# Altium schematic sheet [05] INERTIAL SENSOR.SchDoc: Template
size A4; Author: Hom; CompanyName: KitSprout; DrawnBy: Hom; Engineer: Hom; Organization: KitSprout; Revision: A; SheetNumber: 5; SheetTotal: 6; Version: 0.0; LibVersion: 0.0
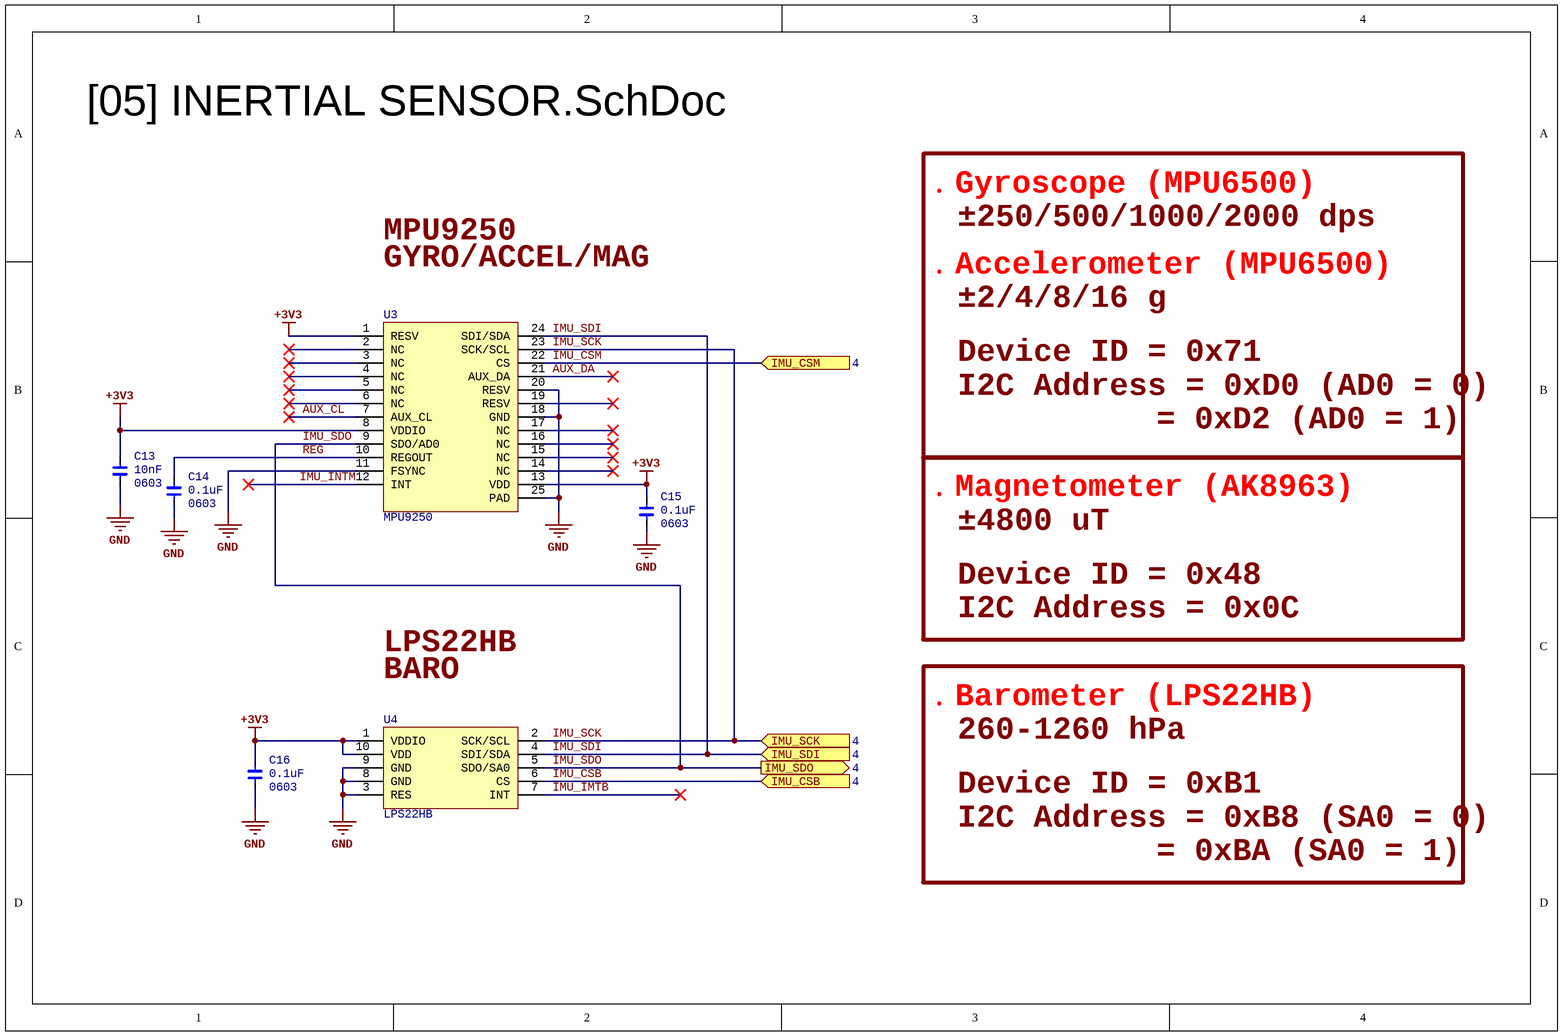
[diagram p0: [05] INERTIAL SENSOR.SchDoc]

## Parts
C13  Type: 0603  [CAP_0603]  (hidden comment: 10nF)
C14  Type: 0603  [CAP_0603]  (hidden comment: 0.1uF)
C15  Type: 0603  [CAP_0603]  (hidden comment: 0.1uF)
C16  Type: 0603  [CAP_0603]  (hidden comment: 0.1uF)
U3  MPU9250  [QFN_P0.4_24]
U4  LPS22HB  [HCLGA-2x2_10]

## Ports
IMU_CSB (in, see 4), IMU_CSM (in, see 4), IMU_SCK (in, see 4), IMU_SDI (in, see 4), IMU_SDO (out, see 4)

## Nets
+3V3: C13.2 C15.2 C16.2 U3.1(RESV) U3.8(VDDIO) U3.13(VDD) U4.1(VDDIO) U4.10(VDD)
GND: C13.1 C14.1 C15.1 C16.1 U3.11(FSYNC) U3.18(GND) U3.20(RESV) U3.25(PAD) U4.3(RES) U4.8(GND) U4.9(GND)
AUX_CL: U3.7(AUX_CL)
AUX_DA: U3.21(AUX_DA)
IMU_CSB: U4.6(CS) ; port IMU_CSB
IMU_CSM: U3.22(CS) ; port IMU_CSM
IMU_IMTB: U4.7(INT)
IMU_INTM: U3.12(INT)
IMU_SCK: U3.23(SCK/SCL) U4.2(SCK/SCL) ; port IMU_SCK
IMU_SDI: U3.24(SDI/SDA) U4.4(SDI/SDA) ; port IMU_SDI
IMU_SDO: U3.9(SDO/AD0) U4.5(SDO/SA0) ; port IMU_SDO
REG: C14.2 U3.10(REGOUT)

Not connected (* = marked no-connect by the designer): U3 2(NC)* 3(NC)* 4(NC)* 5(NC)* 6(NC)* 14(NC)* 15(NC)* 16(NC)* 17(NC)* 19(RESV)*

## Notes on the sheet
- MPU9250
- ．Gyroscope (MPU6500)
- ±250/500/1000/2000 dps
- GYRO/ACCEL/MAG
- ．Accelerometer (MPU6500)
- ±2/4/8/16 g
- Device ID = 0x71
- I2C Address = 0xD0 (AD0 = 0)
- = 0xD2 (AD0 = 1)
- ．Magnetometer (AK8963)
- ±4800 uT
- LPS22HB
- I2C Address = 0x0C
- Device ID = 0x48
- BARO
- ．Barometer (LPS22HB)
- 260-1260 hPa
- Device ID = 0xB1
- I2C Address = 0xB8 (SA0 = 0)
- = 0xBA (SA0 = 1)

## Library data of the parts
C13-C16 = Cap_0603: Capacitor
  C13: Value: 10nF
  C14-C16: Value: 0.1uF
U3 = MPU925x: Sensor Motion; Type: QFN24 P0.4
U4 = LPS22HB: Sensor Pressure; Type: LGA10 P0.5